# EAGLE design 5_Way_Flex_Switch (EAGLE 6.3)

## Sheet 1 of 2
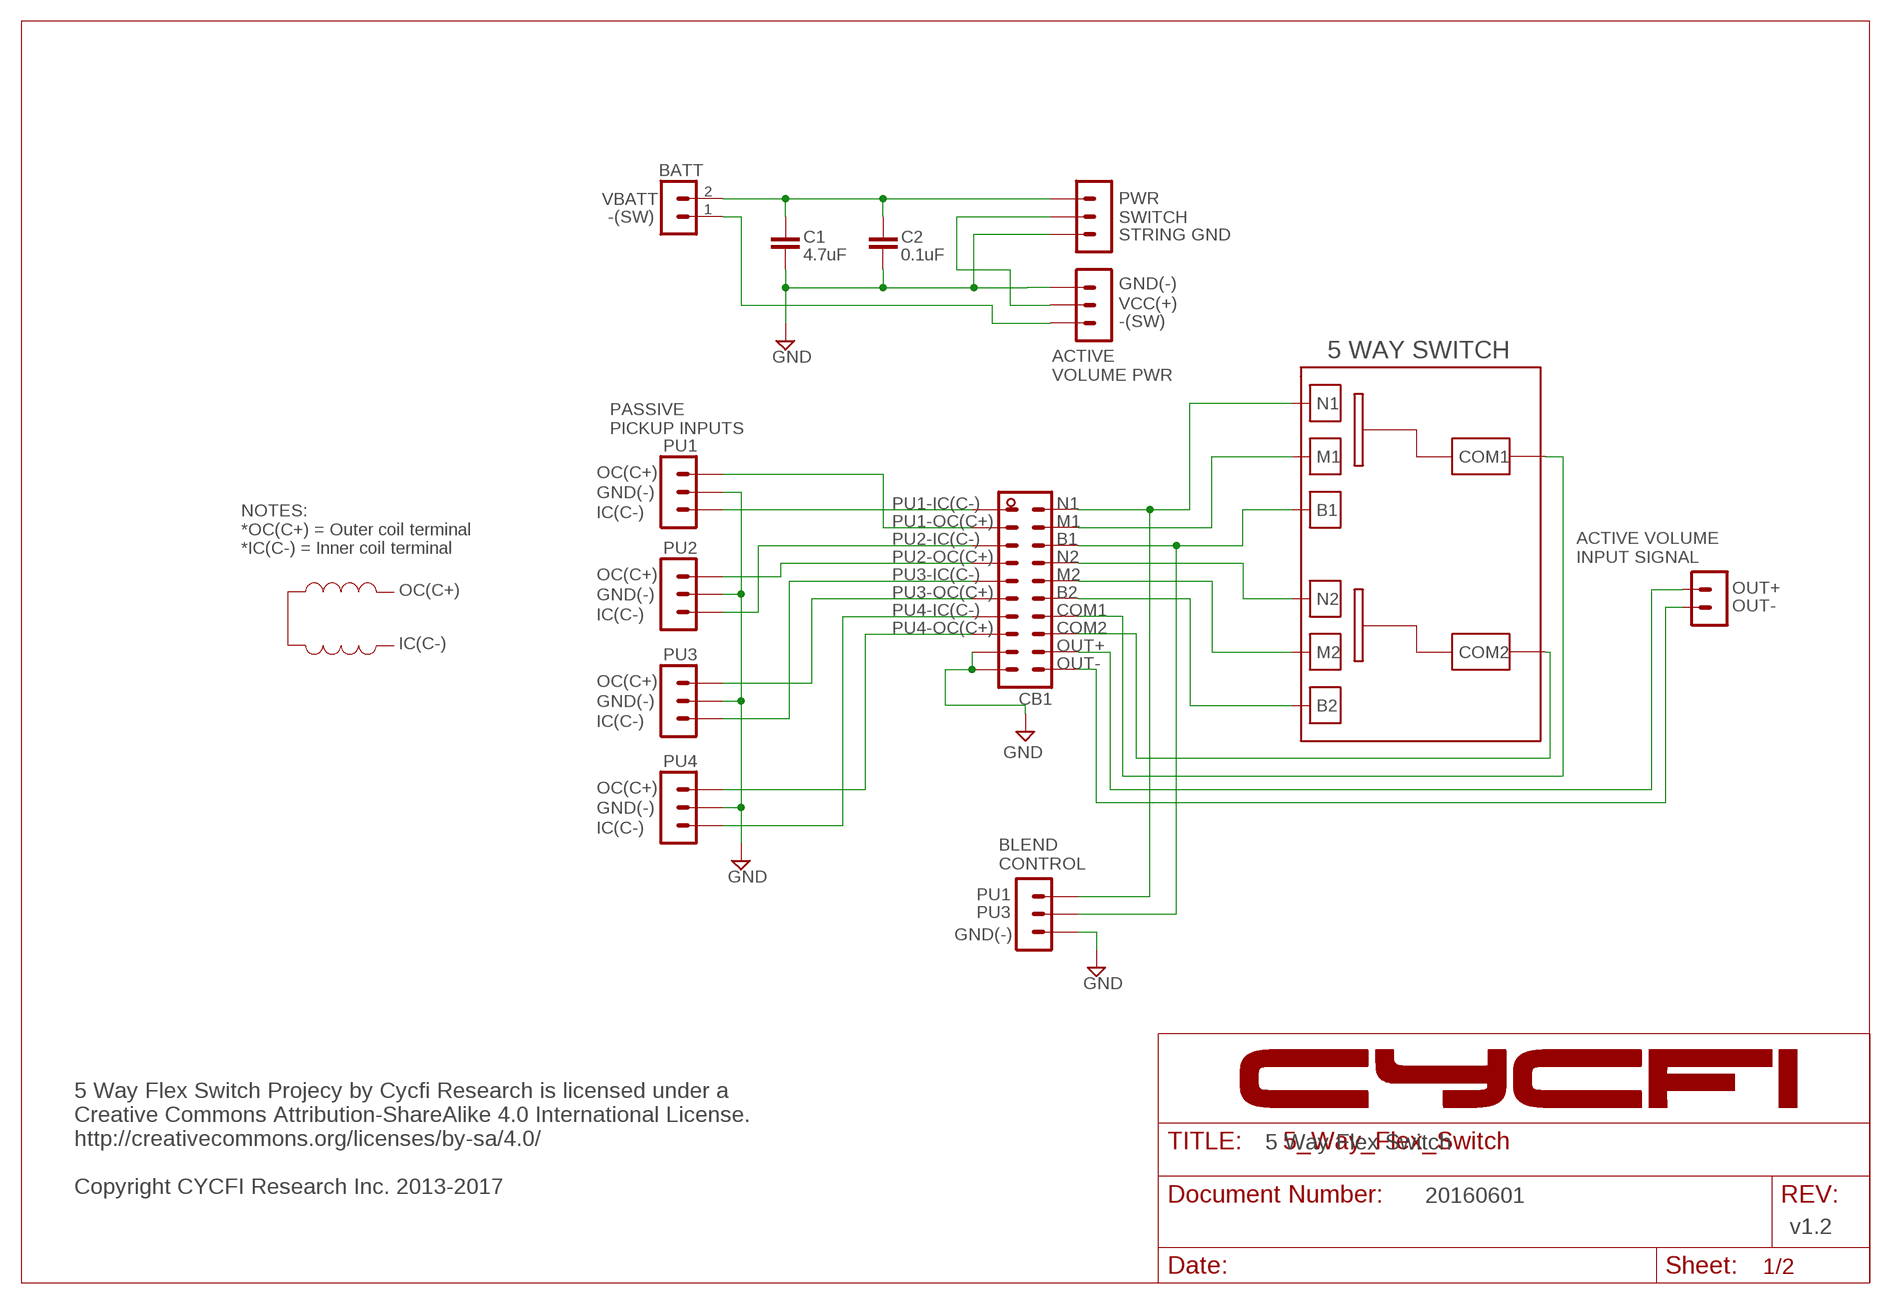
[diagram p0: schematic, sheet 1]

### Parts
C1  4.7uF  C-EUC0603  [C0603]
C2  0.1uF  C-EUC0603  [C0603]
CB1  CONFIGURATION_BRD_PADS  [CONFIGURATION_BRD_PADS]
H1  MA02-1  [MA02-1]
H3  3PIN-SMD-2.54MM  [3P-SMD-2.54MM]
U$1  5WAY_SW_CASTELLATED  [5WAY_SW_CASTELLATED]

### Nets
1-IC: CB1.1-IC ; also sheet 2
1-OC: CB1.1-OC ; also sheet 2
2-IC: CB1.2-IC ; also sheet 2
2-OC: CB1.2-OC ; also sheet 2
3-IC: CB1.3-IC ; also sheet 2
3-OC: CB1.3-OC ; also sheet 2
4-IC: CB1.4-IC ; also sheet 2
4-OC: CB1.4-OC ; also sheet 2
B1: CB1.B1 U$1.B1 ; also sheet 2
GND: C1.2 C2.2 CB1.GND CB1.GND1 H3.P$3 ; also sheet 2
IN+: CB1.OUT- ; also sheet 2
IN-: CB1.OUT+ ; also sheet 2
N1: CB1.N1 U$1.N1 ; also sheet 2
N$2: CB1.COM2 U$1.COM2
N$3: CB1.COM1 U$1.COM1
N$13: CB1.M1 U$1.M1
N$15: CB1.N2 U$1.N2
N$16: CB1.M2 U$1.M2
N$17: CB1.B2 U$1.B2
SW: H1.1 ; also sheet 2
VBATT: C1.1 C2.1 H1.2 H3.P$1 ; also sheet 2
VCC: H3.P$2 ; also sheet 2

### Notes on the sheet
- BATT
- VBATT
- -(SW)
- PWR
  SWITCH
- STRING GND
- GND(-)
- VCC(+)
- -(SW)
- ACTIVE 
  VOLUME PWR
- PASSIVE
  PICKUP INPUTS
- PU1
- OC(C+)
- GND(-)
- PU1-IC(C-) | N1
- IC(C-)
- PU1-OC(C+) | M1
- PU2-IC(C-) | B1
- NOTES:
  *OC(C+) = Outer coil terminal
  *IC(C-) = Inner coil terminal
- PU2
- PU2-OC(C+) | N2
- ACTIVE VOLUME
  INPUT SIGNAL
- OC(C+) | PU3-IC(C-) | M2
- OC(C+) | PU3-OC(C+) | B2 | OUT+
- GND(-)
- PU4-IC(C-) | COM1 | OUT-
- IC(C-)
- PU4-OC(C+) | COM2
- IC(C-) | OUT+
- PU3
- OUT-
- OC(C+)
- GND(-)
- IC(C-)
- PU4
- OC(C+)
- GND(-)
- IC(C-)
- BLEND 
  CONTROL
- PU1
- PU3
- GND(-)
- 5 Way Flex Switch
- 5 Way Flex Switch Projecy by Cycfi Research is licensed under a 
  Creative Commons Attribution-ShareAlike 4.0 International License.
  http://creativecommons.org/licenses/by-sa/4.0/
  
  Copyright CYCFI Research Inc. 2013-2017
- 20160601
- v1.2

## Sheet 2 of 2
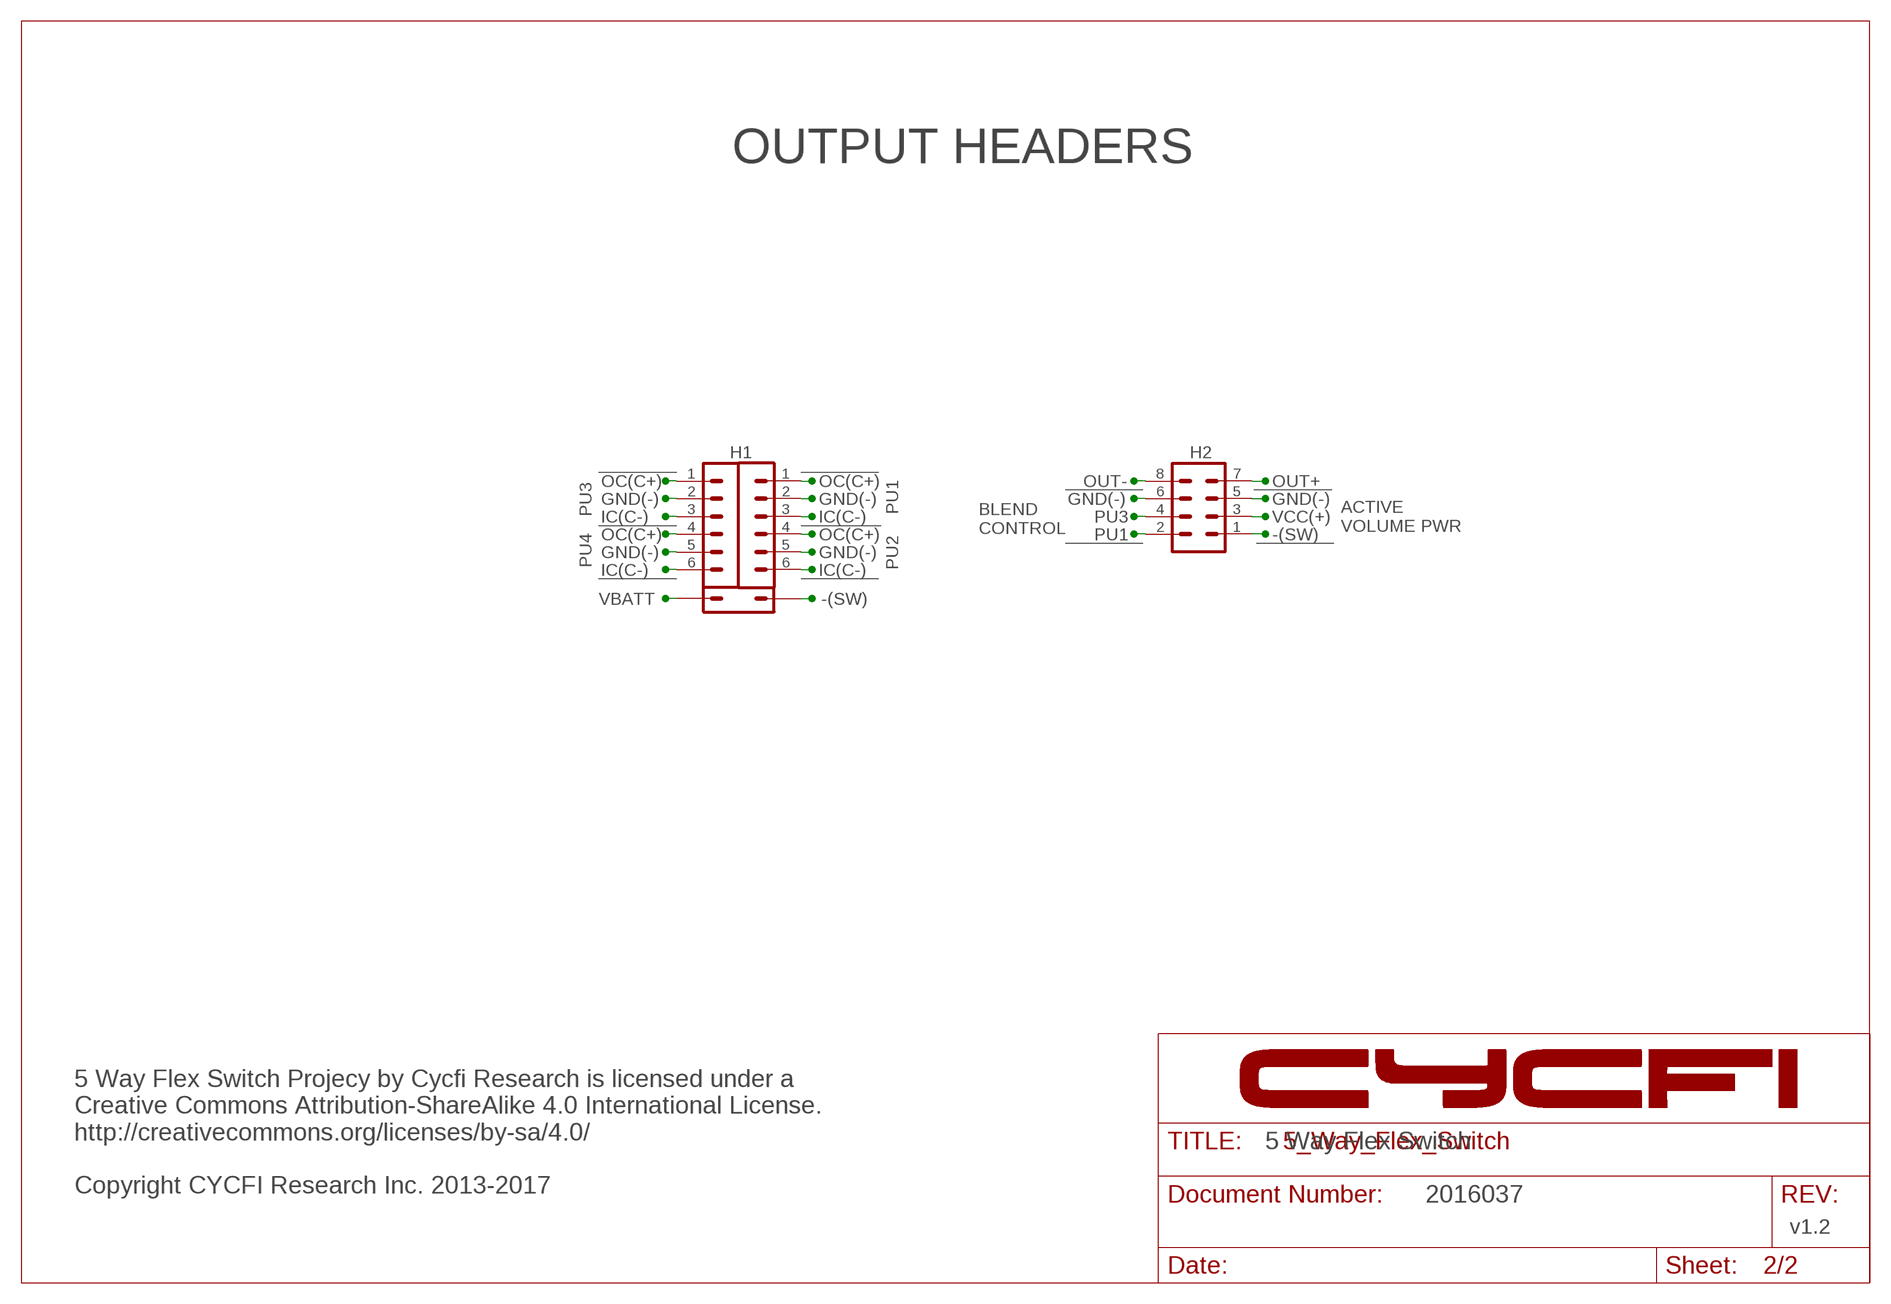
[diagram p1: schematic, sheet 2]

### Parts
H2  MA04-2  [MA04-2]
H4  MA06-1EDITED  [MA06-1_]
H5  MA06-1EDITED  [MA06-1_]

### Nets
1-IC: H4.3 ; also sheet 1
1-OC: H4.1 ; also sheet 1
2-IC: H4.6 ; also sheet 1
2-OC: H4.4 ; also sheet 1
3-IC: H5.3 ; also sheet 1
3-OC: H5.1 ; also sheet 1
4-IC: H5.6 ; also sheet 1
4-OC: H5.4 ; also sheet 1
B1: H2.4 ; also sheet 1
GND: H2.5 H2.6 H4.2 H4.5 H5.2 H5.5 ; also sheet 1
IN+: H2.7 ; also sheet 1
IN-: H2.8 ; also sheet 1
N1: H2.2 ; also sheet 1
SW: H2.1 ; also sheet 1
VCC: H2.3 ; also sheet 1

### Notes on the sheet
- OUTPUT HEADERS
- H1
- OC(C+) | OC(C+) | OUT- | OUT+
- GND(-) | GND(-) | GND(-) | GND(-)
- PU3 | PU1
- IC(C-) | IC(C-) | PU3 | VCC(+)
- ACTIVE
  VOLUME PWR
- BLEND 
  CONTROL
- OC(C+) | OC(C+) | PU1 | -(SW)
- GND(-) | GND(-)
- PU4 | PU2
- IC(C-) | IC(C-)
- VBATT | -(SW)
- 5 Way Flex Switch
- 5 Way Flex Switch Projecy by Cycfi Research is licensed under a 
  Creative Commons Attribution-ShareAlike 4.0 International License.
  http://creativecommons.org/licenses/by-sa/4.0/
  
  Copyright CYCFI Research Inc. 2013-2017
- 2016037
- v1.2

## Library data of the parts
C1 C2 = resistor:C-EU: CAPACITOR, European symbol
CB1 = CYCFI_Module_castellated:CONFIGURATION_BRD_PADS
H1 = con-lstb:MA02-1
H2 = con-lstb:MA04-2: PIN HEADER; OC_FARNELL: unknown; OC_NEWARK: unknown
H3 = CYCFI_Con:3PIN-SMD-2.54MM
H4 H5 = con-lstb:MA06-1: PIN HEADER
U$1 = CYCFI_switch:5WAY_SW

## Board
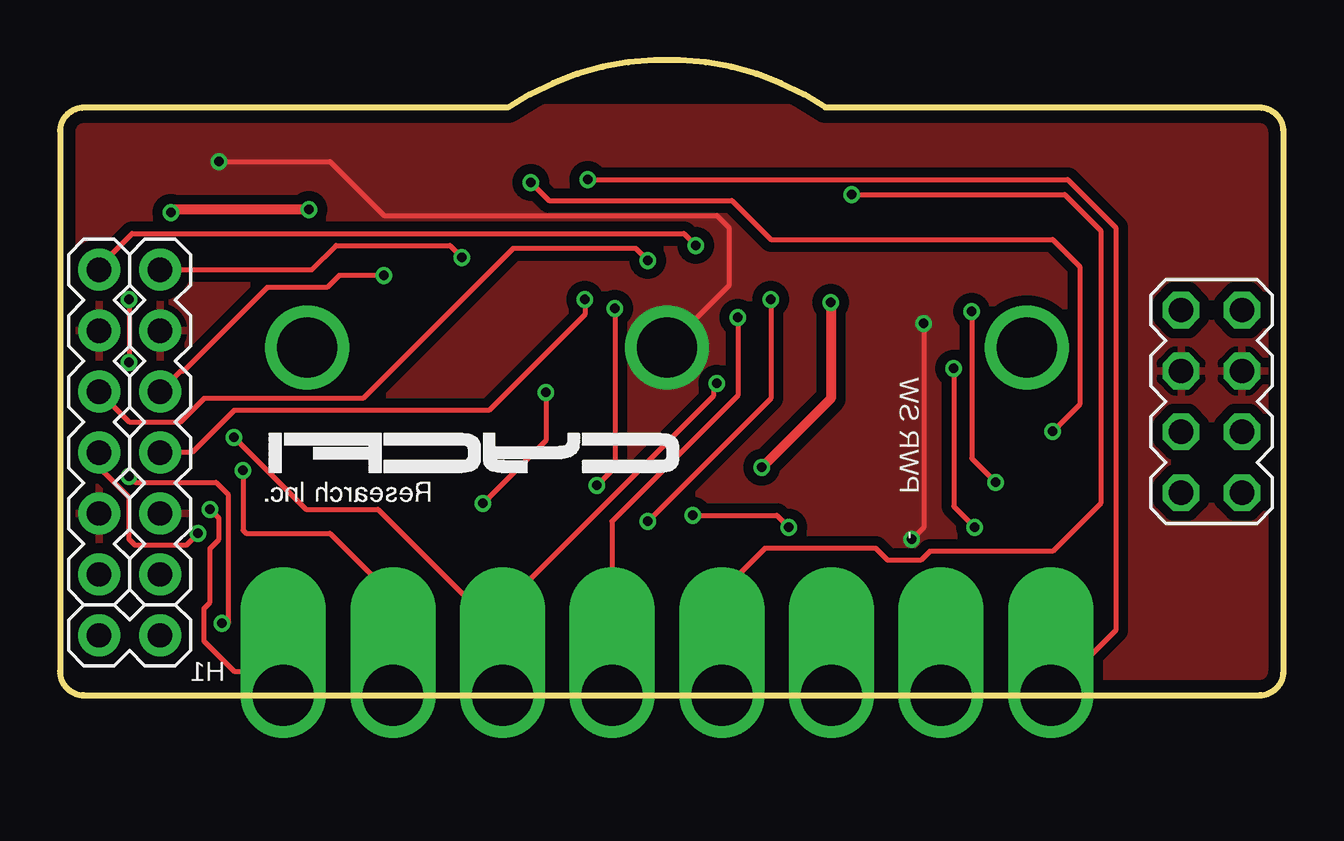
[diagram p2: board, top side]
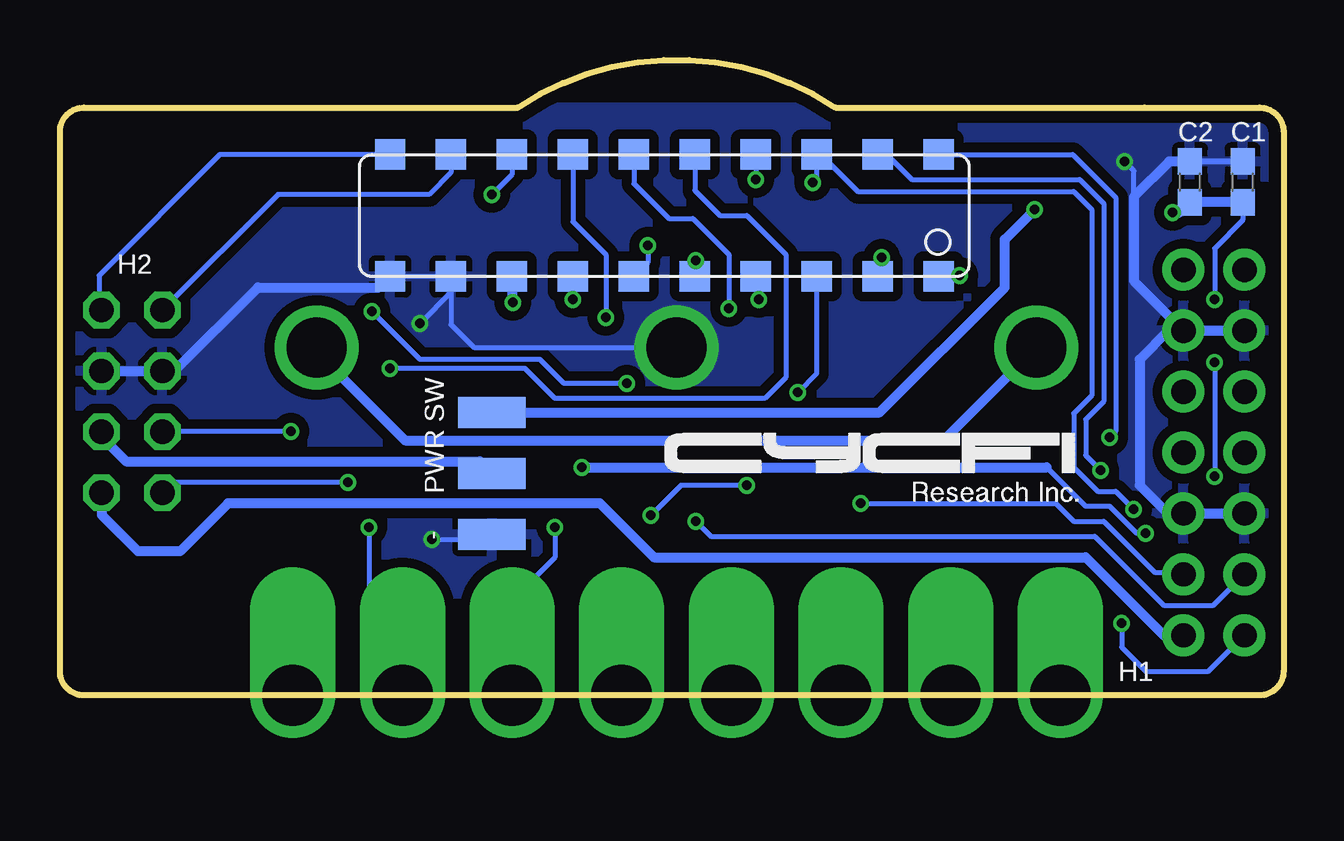
[diagram p3: board, bottom side, seen from below]

Size 51 x 26.49 mm. Coordinates in mm from the lower left corner, seen from the top.
Outline: 5.8,24.5 18.67,24.5 arc-67 31.93,24.5 44.8,24.5
Outline: 31.9,24.5 50,24.5 arc-90 51,23.5 51,1 arc-90 50,0 1,0 arc-90 0,1 0,23.5 arc-90 1,24.5 5.8,24.5
Copper layers (1*16): Top 0.035mm / dielectric 1.6mm / Bottom 0.035mm
Design rules "Elecrow_2-layer_PCB_eagle_rule": minimum track width 6mil, minimum drill 12mil, track to track 6mil, track to pad 8mil, pad to pad 12mil, via to via 12mil, smd to smd 0mil, copper to edge 20mil, drill to drill 10mil, minimum pad ring 6mil, minimum via ring 6mil, stop-mask expansion 0mil, vias tented up to drill 100mil, thermal gap 10mil

### Footprints (pad centres in the part's own frame; a part is rotated, then mirrored left to right if it is on the bottom)
C0603 = smd 1.1 x 1: 1 -0.85,0; 2 0.85,0
CONFIGURATION_BRD_PADS = smd 1.27 x 1.27 bottom: 1-IC -7.62,-2.54; 1-OC -5.08,-2.54; 2-IC -2.54,-2.54; 2-OC 0,-2.54; 3-IC 2.54,-2.54; 3-OC 5.08,-2.54; 4-IC 7.62,-2.54; 4-OC 10.16,-2.54; B1 -2.54,2.54; B2 5.08,2.54; COM1 7.62,2.54; COM2 10.16,2.54; GND 12.7,-2.54; GND1 15.24,-2.54; M1 -5.08,2.54; M2 2.54,2.54; N1 -7.62,2.54; N2 0,2.54; OUT+ 12.7,2.54; OUT- 15.24,2.54
MA02-1 = drill 1.016 pad 1.75: 1 -1.27,0; 2 1.27,0
MA04-2 = drill 1.016 octagon: 1 -3.81,-1.27; 2 -3.81,1.27; 3 -1.27,-1.27; 4 -1.27,1.27; 5 1.27,-1.27; 6 1.27,1.27; 7 3.81,-1.27; 8 3.81,1.27
3P-SMD-2.54MM = smd 1.3 x 2.8: P$1 -2.54,0; P$2 0,0; P$3 2.54,0
MA06-1_ = drill 1.016 pad 1.75: 1 -6.35,0; 2 -3.81,0; 3 -1.27,0; 4 1.27,0; 5 3.81,0; 6 6.35,0
5WAY_SW_CASTELLATED = drill 2.54 offset: B1 -15.995,0; B2 6.855,0; COM1 -2.285,0; COM2 2.285,0; M1 -11.425,0; M2 11.425,0; N1 -6.855,0; N2 15.995,0

### Placement (x,y rotation side)
C1  1.7,21.4 90 bottom
C2  3.9,21.4 90 bottom
CB1  22,20 0 top
H1  2.9,2.5 180 top
H2  48,12.25 90 top
H3  33,9.25 270 bottom
H4  4.17,11.39 270 top
H5  1.63,11.39 270 top
U$1  25.3,0 0 top

### Tracks (layer width: path | path; a pad name or v marks a point on that pad's centre or on a via)
1-IC  (via drill 0.4)
  Top 0.203: v13.5,17.5 11.62,17.5 11.12,17 8.62,17 5.12,13.5 5.01,13.5 H4.3
  Bottom 0.203: CB1.1-IC 13.54,17.46 v13.5,17.5
1-OC  (via drill 0.4)
  Top 0.203: H4.1 10.49,17.74 11.5,18.75 16.25,18.75 v16.75,18.25
  Bottom 0.203: v16.75,18.25 16.75,17.63 CB1.1-OC
2-IC  (via drill 0.4)
  Top 0.203: v20.25,12.62 20.25,10.62 v17.62,8
  Bottom 0.203: CB1.2-IC 19.46,13.41 v20.25,12.62 | v17.62,8 9.5,8 8.75,7.25 7.5,7.25 5.38,5.12 4.25,5.12 H4.6
2-OC  (via drill 0.4)
  Top 0.203: v21.88,16.5 21.88,15.88 17.88,11.88 7.25,11.88 5.5,10.12 H4.4
  Bottom 0.203: CB1.2-OC 22,16.62 v21.88,16.5
3-IC  (via drill 0.4)
  Top 0.203: v24.5,18.12 24,18.62 18.88,18.62 12.62,12.38 6,12.38 5,11.38 2.92,11.38 H5.3
  Bottom 0.203: CB1.3-IC 24.54,18.09 v24.5,18.12
3-OC  (via drill 0.4)
  Top 0.203: H5.1 1.63,17.88 3,19.25 26,19.25 v26.5,18.75
  Bottom 0.203: v26.5,18.75 26.5,18.04 CB1.3-OC
4-IC  (via drill 0.4)
  Top 0.203: v29.62,16.5 29.62,12.38 v24.5,7.25
  Bottom 0.203: CB1.4-IC v29.62,16.5 | v24.5,7.25 23.88,6.62 7.88,6.62 5,3.75 2.92,3.75 H5.6
4-OC  (via drill 0.4)
  Top 0.203: v5.75,6.75 5.25,6.25 3.12,6.25 2.88,6.5 2.88,8.25 1.62,9.5 H5.4
  Top 0.406: v32.12,16.38 32.12,12.38 v29.25,9.5
  Bottom 0.203: v5.75,6.75 6.12,6.75 7.25,7.88 8.25,7.88 9.88,9.5
  Bottom 0.406: CB1.4-OC 32.16,16.41 v32.12,16.38 | v29.25,9.5 9.88,9.5
B1  (via drill 0.4)
  Top 0.203: U$1.B1 8.3,1 7.25,1 6,2.25 6,3.62 6.25,3.88 6.25,6.12 6.62,6.5 6.62,7.38 v6.25,7.75 | v19.62,21.38 20.38,20.62 28,20.62 29.62,19 41.38,19 42.5,17.88 42.5,12.12 v41.38,11
  Bottom 0.203: v6.25,7.75 7,8.5 7.75,8.5 8.75,9.5 8.75,11.75 8,12.5 8,20.25 8.75,21 17.75,21 19.29,22.54 CB1.B1 19.46,21.54 v19.62,21.38 | v41.38,11 46.71,11 H2.4
GND  (via drill 0.4, 2.5)
  Top 0.203: v36,15.5 36,7 v35.5,6.5 | v6.62,22.25 11.25,22.25 13.5,20 27.38,20 27.88,19.5 27.88,17.07 v25.3,14.5
  Bottom 0.203: CB1.GND CB1.GND1 | CB1.GND 34.7,16.8 v36,15.5 | v35.5,6.5 33.21,6.5 H3.P$3 | CB1.GND 34.7,15.45 33.75,14.5 v25.3,14.5 | 6.24,17.27 6.24,21.86 v6.62,22.25
  Bottom 0.254: C1.2 C2.2
  Bottom 0.406: C2.2 4.77,22.25 6.24,20.78 6.24,17.27 H4.2 | H4.2 H5.2 | H4.2 4.8,15.2 6,14 6,8.75 4.75,7.5 4.25,7.5 H4.5 H5.5 | H2.5 H2.6 46.23,13.52 42.75,17 37.7,17 CB1.GND1
  pour Top (isolate 0.406): 0,23.5 0,1 arc90 1,0 50,0 arc90 51,1 51,23.5 arc90 50,24.5 1,24.5 arc90
  pour Bottom (isolate 0.406): 50,0 1,0 arc-90 0,1 0,23.5 arc-90 1,24.5 50,24.5 arc-90 51,23.5 51,1 arc-90
GND1  (via drill 2.5)
  Bottom 0.406: v40.3,14.5 40.3,14.3 36.62,10.62 14.18,10.62 v10.3,14.5
IN+
  Bottom 0.203: CB1.OUT- 44.34,22.54 49.38,17.5 49.38,16.16 H2.7
IN-
  Bottom 0.203: CB1.OUT+ 34.7,21.8 35.62,20.88 41.91,20.88 H2.8
N1  (via drill 0.4)
  Top 0.203: 18.25,2.75 13.25,7.75 10.25,7.75 v7.25,10.75 | 18.25,2.75 18.25,0.2 U$1.N1 | 18.25,2.75 18.25,3.5 27.25,12.5 27.25,12.88 v27.38,13 | v38,16 38,9.88 v39,8.88
  Bottom 0.203: CB1.N1 8.79,22.54 7,20.75 7,11 v7.25,10.75 | v27.38,13 30,13 31,14 36,14 v38,16 | v39,8.88 46.3,8.88 H2.2
N$2  (via drill 0.4)
  Top 0.203: v33,20.88 41.88,20.88 43.38,19.38 43.38,8 41.38,6 36.25,6 35.88,5.62 34.5,5.62 34,6.12 29.38,6.12 27.62,4.38 27.62,0.04 U$1.COM2
  Bottom 0.203: CB1.COM2 32.16,21.71 v33,20.88
N$3  (via drill 0.4)
  Top 0.203: v28.25,15.75 28.25,12.5 23,7.25 23,0.01 U$1.COM1
  Bottom 0.203: CB1.COM1 29.62,19.75 28.25,18.38 v28.25,15.75
N$13  (via drill 0.4)
  Top 0.203: U$1.M1 13.75,0.12 13.75,4.25 11.25,6.75 7.75,6.75 7.62,6.88 v7.62,9.38
  Bottom 0.203: CB1.M1 16.54,22.54 15.5,21.5 8.5,21.5 7.5,20.5 7.5,12.25 8.25,11.5 8.25,10 v7.62,9.38
N$15  (via drill 0.4)
  Top 0.203: v22,21.5 42,21.5 44,19.5 44,2.71 U$1.N2
  Bottom 0.203: CB1.N2 v22,21.5
N$16  (via drill 0.4)
  Top 0.203: v37.25,13.62 37.25,7.88 v38.12,7
  Bottom 0.203: CB1.M2 24.54,21.04 23.5,20 22.38,20 20.75,18.38 20.75,13.25 21.62,12.38 30.38,12.38 31.62,13.62 v37.25,13.62 | v38.12,7 38.12,1.4 U$1.M2
N$17  (via drill 0.4)
  Top 0.203: v23.12,16.12 23.12,9.5 v22.38,8.75 | v26.38,7.5 29.88,7.5 v30.38,7
  Bottom 0.203: CB1.B2 27.08,21.33 25.62,19.88 24.62,19.88 23.12,18.38 v23.12,16.12 | v22.38,8.75 25.12,8.75 v26.38,7.5 | v30.38,7 30.38,5.75 32.25,3.88 32.25,0.1 U$1.B2
SW
  Bottom 0.406: H2.1 49.25,8.42 49.25,7.5 47.75,6 46,6 44,8 28.5,8 26.25,5.75 8.25,5.75 5,2.5 H1.1
VBATT  (via drill 0.4)
  Top 0.203: v2.88,16.5 v2.88,13.88 | v2.88,9.12 3.12,8.88 6.5,8.88 7,8.38 7,3 v6.75,3
  Top 0.406: v10.38,20.25 4.75,20.25 v4.62,20.12
  Bottom 0.203: C1.1 1.7,19.8 2.88,18.62 v2.88,16.5 | v2.88,13.88 v2.88,9.12 | H1.2 3.13,1 5.75,1 6.75,2 v6.75,3
  Bottom 0.406: C1.1 C2.1 4.33,20.12 v4.62,20.12 | H3.P$1 16.84,11.79 11.62,17 11.62,19 v10.38,20.25
VCC
  Bottom 0.406: H2.3 49.27,10.77 48.25,9.75 33.5,9.75 H3.P$2

### Text on the board
bNames: PWR SW | - | H1
_tNames: PWR SW | - | H1
_bNames: C1 | C2 | H2 | PWR SW | - | H1